# EAGLE design PCB_REVISION2WORKING (EAGLE 9.3.0)
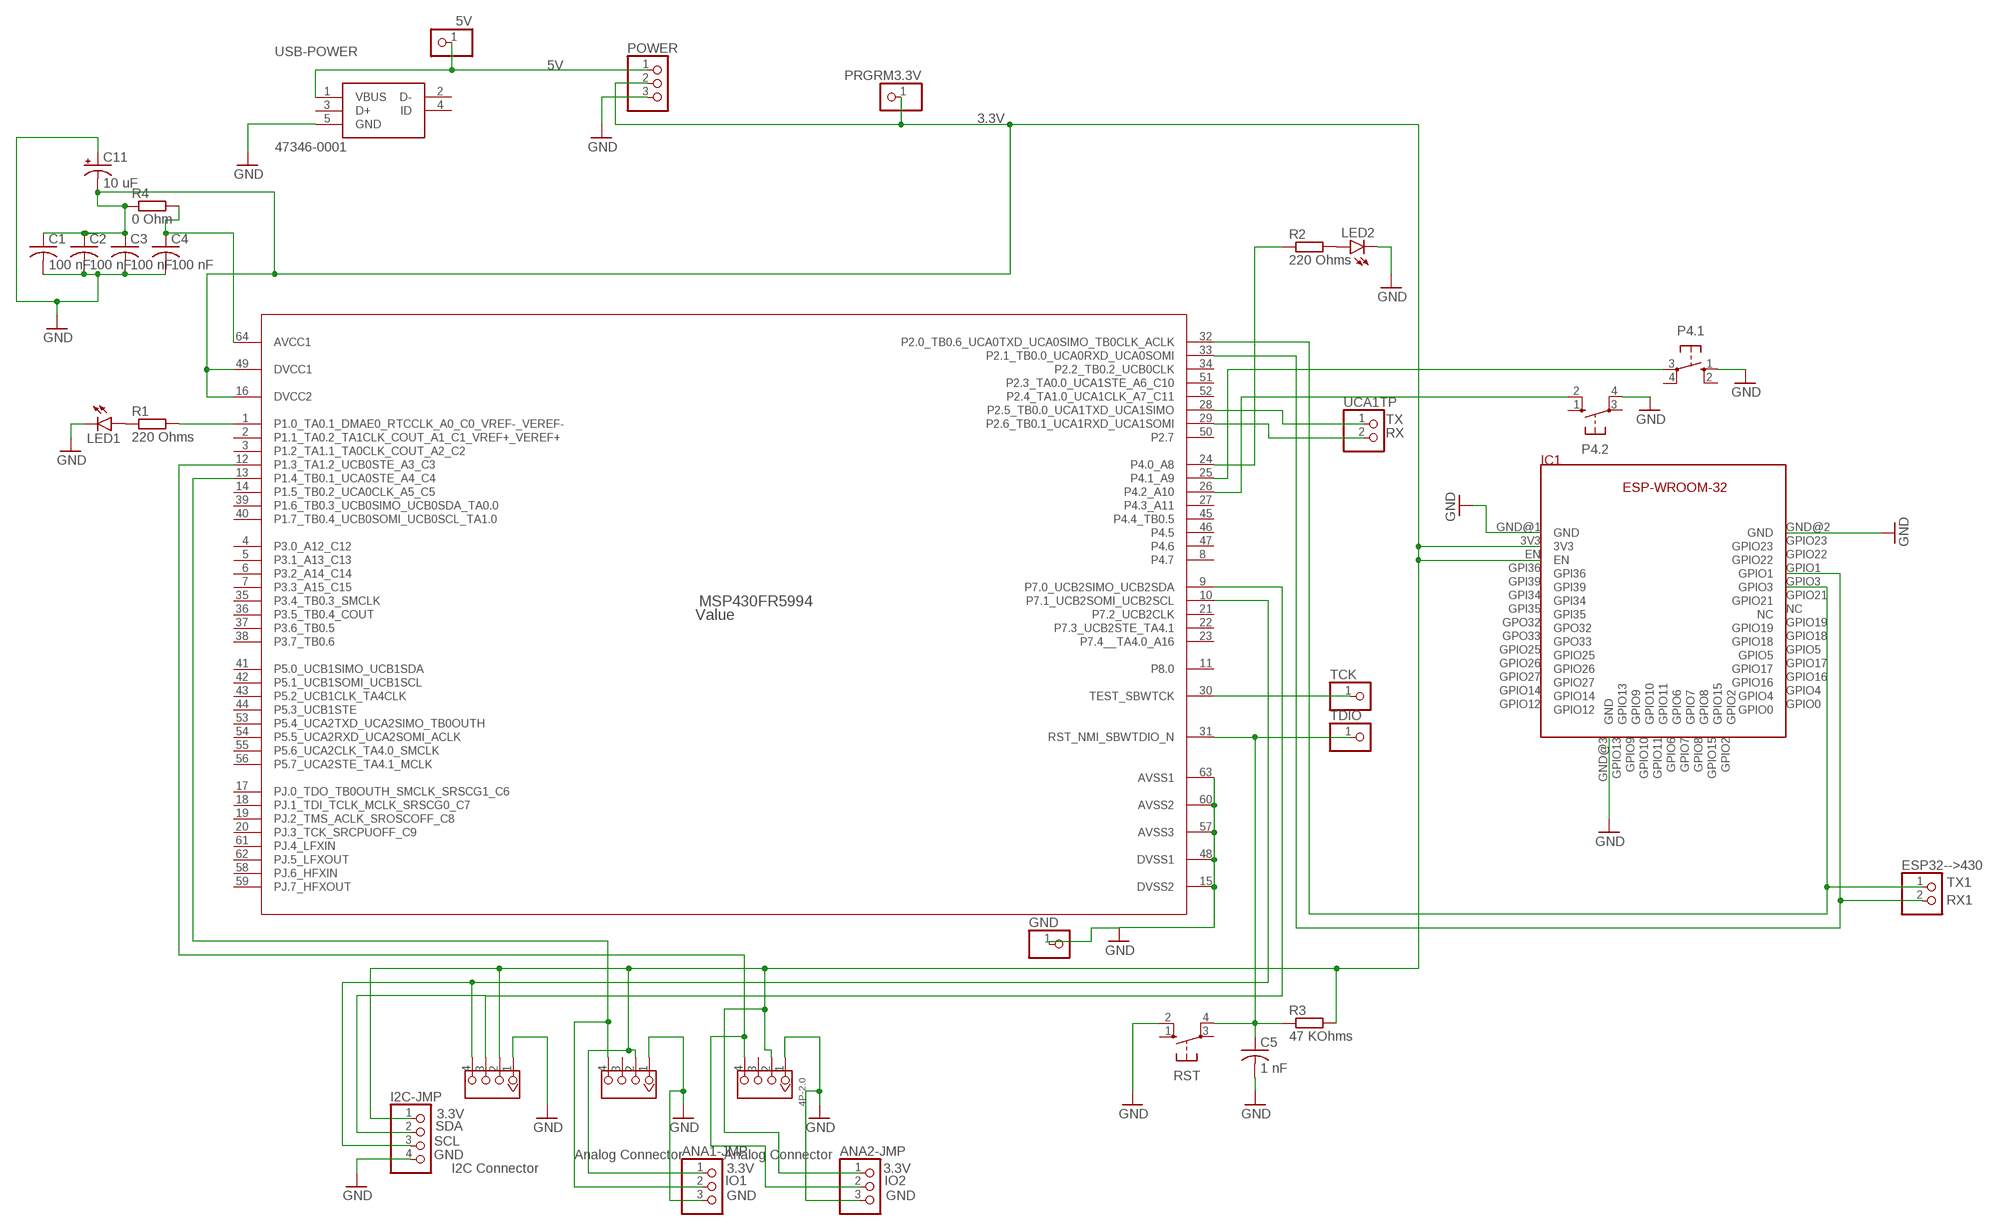
[diagram p0: schematic, sheet 1]

## Parts
5V  PINHD-1X1  [1X01]
ANA1-JMP  PINHD-1X3  [1X03]
ANA2-JMP  PINHD-1X3  [1X03]
ANALOG1  4P-2.0  GROVE-CONNECTOR-DIP(4P-2.0)  [HW4-2.0]
ANALOG2  4P-2.0  GROVE-CONNECTOR-DIP(4P-2.0)  [HW4-2.0]
C1  100 nF  C-USC0805K  [C0805K]
C2  100 nF  C-USC0805K  [C0805K]
C3  100 nF  C-USC0805K  [C0805K]
C4  100 nF  C-USC0805K  [C0805K]
C5  1 nF  C-USC0805K  [C0805K]
C11  10 uF  CPOL-USE5-6  [E5-6]
ESP32-->430  PINHD-1X2  [1X02]
GND  PINHD-1X1  [1X01]
I2C  4P-2.0  GROVE-CONNECTOR-DIP(4P-2.0)  [HW4-2.0]
I2C-JMP  PINHD-1X4  [1X04]
IC1  ESPWROOM32  [ESPWROOM32]
LED1  LED5MM  [LED5MM]
LED2  LED5MM  [LED5MM]
MSP430FR5994  Value  MSP430FR5964IPMR  [PM0064A_N]
P4.1  10-XX  [B3F-10XX]
P4.2  10-XX  [B3F-10XX]
POWER  PINHD-1X3  [1X03]
PRGRM3.3V  PINHD-1X1  [1X01]
R1  220 Ohms  R-EU_M1206  [M1206]
R2  220 Ohms  R-EU_M1206  [M1206]
R3  47 KOhms  R-EU_M1206  [M1206]
R4  0 Ohm  R-EU_M1206  [M1206]
RST  10-XX  [B3F-10XX]
TCK  PINHD-1X1  [1X01]
TDIO  PINHD-1X1  [1X01]
UCA1TP  PINHD-1X2  [1X02]
USB-POWER  47346-0001  [47346-0001]

## Nets
3.3V: ANA1-JMP.1 ANA2-JMP.1 ANALOG1.2 ANALOG2.2 C1.1 C2.1 C3.1 C11.- I2C-JMP.1 I2C.2 IC1.3V3 IC1.EN MSP430FR5994.16(DVCC2) MSP430FR5994.49(DVCC1) POWER.2 PRGRM3.3V.1 R3.2 R4.1
5V: 5V.1 POWER.1 USB-POWER.1(VBUS)
GND: ANA1-JMP.3 ANA2-JMP.3 ANALOG1.1 ANALOG2.1 C1.2 C2.2 C3.2 C4.2 C5.2 C11.+ GND.1 I2C-JMP.4 I2C.1 IC1.GND@1(GND) IC1.GND@2(GND) IC1.GND@3(GND) LED1.K(C) LED2.K(C) MSP430FR5994.15(DVSS2) MSP430FR5994.48(DVSS1) MSP430FR5994.57(AVSS3) MSP430FR5994.60(AVSS2) MSP430FR5994.63(AVSS1) P4.1.1(S) P4.2.4(P1) POWER.3 RST.2(S1) USB-POWER.5(GND)
IO1: ANA1-JMP.2 ANALOG1.4 MSP430FR5994.13(P1.4_TB0.1_UCA0STE_A4_C4)
IO2: ANA2-JMP.2 ANALOG2.4 MSP430FR5994.12(P1.3_TA1.2_UCB0STE_A3_C3)
N$2: LED1.A R1.1
N$3: LED2.A R2.2
N$10: MSP430FR5994.1(P1.0_TA0.1_DMAE0_RTCCLK_A0_C0_VREF-_VEREF-) R1.2
N$12: C5.1 MSP430FR5994.31(RST_NMI_SBWTDIO_N) R3.1 RST.4(P1) TDIO.1
N$13: MSP430FR5994.25(P4.1_A9) P4.1.3(P)
N$14: MSP430FR5994.26(P4.2_A10) P4.2.2(S1)
N$16: MSP430FR5994.24(P4.0_A8) R2.1
N$17: C4.1 MSP430FR5994.64(AVCC1) R4.2
N$21: MSP430FR5994.30(TEST_SBWTCK) TCK.1
RX: MSP430FR5994.29(P2.6_TB0.1_UCA1RXD_UCA1SOMI) UCA1TP.2
RX1: ESP32-->430.2 IC1.GPIO1 MSP430FR5994.33(P2.1_TB0.0_UCA0RXD_UCA0SOMI)
SCL: I2C-JMP.3 I2C.4 MSP430FR5994.10(P7.1_UCB2SOMI_UCB2SCL)
SDA: I2C-JMP.2 I2C.3 MSP430FR5994.9(P7.0_UCB2SIMO_UCB2SDA)
TX: MSP430FR5994.28(P2.5_TB0.0_UCA1TXD_UCA1SIMO) UCA1TP.1
TX1: ESP32-->430.1 IC1.GPIO3 MSP430FR5994.32(P2.0_TB0.6_UCA0TXD_UCA0SIMO_TB0CLK_ACLK)
Unconnected: ANALOG1.3 ANALOG2.3 IC1.GPI34 IC1.GPI35 IC1.GPI36 IC1.GPI39 IC1.GPIO0 IC1.GPIO2 IC1.GPIO4 IC1.GPIO5 IC1.GPIO6 IC1.GPIO7 IC1.GPIO8 IC1.GPIO9 IC1.GPIO10 IC1.GPIO11 IC1.GPIO12 IC1.GPIO13 IC1.GPIO14 IC1.GPIO15 IC1.GPIO16 IC1.GPIO17 IC1.GPIO18 IC1.GPIO19 IC1.GPIO21 IC1.GPIO22 IC1.GPIO23 IC1.GPIO25 IC1.GPIO26 IC1.GPIO27 IC1.GPO32 IC1.GPO33 IC1.NC MSP430FR5994.2(P1.1_TA0.2_TA1CLK_COUT_A1_C1_VREF+_VEREF+) MSP430FR5994.3(P1.2_TA1.1_TA0CLK_COUT_A2_C2) MSP430FR5994.4(P3.0_A12_C12) MSP430FR5994.5(P3.1_A13_C13) MSP430FR5994.6(P3.2_A14_C14) MSP430FR5994.7(P3.3_A15_C15) MSP430FR5994.8(P4.7) MSP430FR5994.11(P8.0) MSP430FR5994.14(P1.5_TB0.2_UCA0CLK_A5_C5) MSP430FR5994.17(PJ.0_TDO_TB0OUTH_SMCLK_SRSCG1_C6) MSP430FR5994.18(PJ.1_TDI_TCLK_MCLK_SRSCG0_C7) MSP430FR5994.19(PJ.2_TMS_ACLK_SROSCOFF_C8) MSP430FR5994.20(PJ.3_TCK_SRCPUOFF_C9) MSP430FR5994.21(P7.2_UCB2CLK) MSP430FR5994.22(P7.3_UCB2STE_TA4.1) MSP430FR5994.23(P7.4__TA4.0_A16) MSP430FR5994.27(P4.3_A11) MSP430FR5994.34(P2.2_TB0.2_UCB0CLK) MSP430FR5994.35(P3.4_TB0.3_SMCLK) MSP430FR5994.36(P3.5_TB0.4_COUT) MSP430FR5994.37(P3.6_TB0.5) MSP430FR5994.38(P3.7_TB0.6) MSP430FR5994.39(P1.6_TB0.3_UCB0SIMO_UCB0SDA_TA0.0) MSP430FR5994.40(P1.7_TB0.4_UCB0SOMI_UCB0SCL_TA1.0) MSP430FR5994.41(P5.0_UCB1SIMO_UCB1SDA) MSP430FR5994.42(P5.1_UCB1SOMI_UCB1SCL) MSP430FR5994.43(P5.2_UCB1CLK_TA4CLK) MSP430FR5994.44(P5.3_UCB1STE) MSP430FR5994.45(P4.4_TB0.5) MSP430FR5994.46(P4.5) MSP430FR5994.47(P4.6) MSP430FR5994.50(P2.7) MSP430FR5994.51(P2.3_TA0.0_UCA1STE_A6_C10) MSP430FR5994.52(P2.4_TA1.0_UCA1CLK_A7_C11) MSP430FR5994.53(P5.4_UCA2TXD_UCA2SIMO_TB0OUTH) MSP430FR5994.54(P5.5_UCA2RXD_UCA2SOMI_ACLK) MSP430FR5994.55(P5.6_UCA2CLK_TA4.0_SMCLK) MSP430FR5994.56(P5.7_UCA2STE_TA4.1_MCLK) MSP430FR5994.58(PJ.6_HFXIN) MSP430FR5994.59(PJ.7_HFXOUT) MSP430FR5994.61(PJ.4_LFXIN) MSP430FR5994.62(PJ.5_LFXOUT) P4.1.2(S1) P4.1.4(P1) P4.2.1(S) P4.2.3(P) RST.1(S) RST.3(P) USB-POWER.2(D-) USB-POWER.3(D+) USB-POWER.4(ID)

## Notes on the sheet
- Analog Connector | Analog Connector
- I2C Connector

## Library data of the parts
5V GND PRGRM3.3V TCK TDIO = pinhead:PINHD-1X1: PIN HEADER
ANA1-JMP ANA2-JMP POWER = pinhead:PINHD-1X3: PIN HEADER
ANALOG1 ANALOG2 I2C = Seeed-Connector -2016:GROVE-CONNECTOR-DIP(4P-2.0): 320110033
C1-C5 = rcl:C-US: CAPACITOR, American symbol; SPICEPREFIX: C
C11 = rcl:CPOL-US: POLARIZED CAPACITOR, American symbol; SPICEPREFIX: C
ESP32-->430 UCA1TP = pinhead:PINHD-1X2: PIN HEADER
I2C-JMP = pinhead:PINHD-1X4: PIN HEADER
IC1 = robotdyn:ESPWROOM32
LED1 LED2 = led:LED: LED OSRAM: - CHIPLED LG R971, LG N971, LY N971, LG Q971, LY Q971, LO R971, LY R971 LH N974, LH R974 LS Q976, LO Q976, LY Q976 LO Q996 - Hyper CHIPLED LW Q18S LB Q993, LB Q99A, LB R99A - SideLED LS A670, LO A670, LY A670, LG A670, LP A670 LB A673, LV A673, LT A673, LW A673 LH A674 LY A675 LS A676, LA A676, LO A676, LY A676, LW A676 LS A679, LY A679, LG A679 - Hyper Micro SIDELED® LS Y876, LA Y876, LO Y876, LY Y876 LT Y87S - SmartLED LW L88C, LW L88S LB L89C, LB L89S, LG L890 LS L89K, LO L89K, LY L89K LS L896, LA L896, LO L896, LY L896 - TOPLED LS T670, LO T670, LY T670, LG T670, LP T670 LSG T670, LSP T670, LSY T670, LOP T670, LYG T670 LG T671, LOG T671, LSG T671 LB T673, LV T673, LT T673, LW T673 LH T674 LS T676, LA T676, LO T676, LY T676, LB T676, LH T676, LSB T676, LW T676 LB T67C, LV T67C, LT T67C, LS T67K, LO T67K, LY T67K, LW E67C LS E67B, LA E67B, LO E67B, LY E67B, LB E67C, LV E67C, LT E67C LW T67C LS T679, LY T679, LG T679 LS T770, LO T770, LY T770, LG T770, LP T770 LB T773, LV T773, LT T773, LW T773 LH T774 LS E675, LA E675, LY E675, LS T675 LS T776, LA T776, LO T776, LY T776, LB T776 LHGB T686 LT T68C, LB T68C - Hyper Mini TOPLED® LB M676 - Mini TOPLED Santana® LG M470 LS M47K, LO M47K, LY M47K Source: http://www.osram.convergy.de LUXEON: - LUMILED® LXK2-PW12-R00, LXK2-PW12-S00, LXK2-PW14-U00, LXK2-PW14-V00 LXK2-PM12-R00, LXK2-PM12-S00, LXK2-PM14-U00 LXK2-PE12-Q00, LXK2-PE12-R00, LXK2-PE12-S00, LXK2-PE14-T00, LXK2-PE14-U00 LXK2-PB12-K00, LXK2-PB12-L00, LXK2-PB12-M00, LXK2-PB14-N00, LXK2-PB14-P00, LXK2-PB14-Q00 LXK2-PR12-L00, LXK2-PR12-M00, LXK2-PR14-Q00, LXK2-PR14-R00 LXK2-PD12-Q00, LXK2-PD12-R00, LXK2-PD12-S00 LXK2-PH12-R00, LXK2-PH12-S00 LXK2-PL12-P00, LXK2-PL12-Q00, LXK2-PL12-R00 Source: www.luxeon.com KINGBRIGHT: KA-3528ASYC Source: www.kingbright.com
MSP430FR5994 = MSP430 64-pin:MSP430FR5964IPMR; MANUFACTURER: Texas Instruments; PARTNUMBER: MSP430FR5964IPMR; REFDES: RefDes; TYPE: TYPE
P4.1 P4.2 RST = switch-omron:10-XX: OMRON SWITCH; MPN: B3F-1000; OC_FARNELL: 176432; OC_NEWARK: 36M3542
R1-R4 = rcl:R-EU_: RESISTOR, European symbol; SPICEPREFIX: R
USB-POWER = SamacSys_Parts:47346-0001: Micro USB B Receptacle Bottom Mount Assy Molex Right Angle SMT Type B Version 2.0 Micro USB Connector Socket, 30 V ac, 1A 47352 MICRO-USB Source: Datasheet <https://componentsearchengine.com/Datasheets/1/47346-0001.pdf>; DESCRIPTION: Micro USB B Receptacle Bottom Mount Assy Molex Right Angle SMT Type B Version 2.0 Micro USB Connector Socket, 30 V ac, 1A 47352 MICRO-USB; HEIGHT: mm; MANUFACTURER_NAME: Molex; MANUFACTURER_PART_NUMBER: 47346-0001; MOUSER_PART_NUMBER: 538-47346-0001; MOUSER_PRICE-STOCK: https://www.mouser.com/Search/Refine.aspx?Keyword=538-47346-0001

## Board
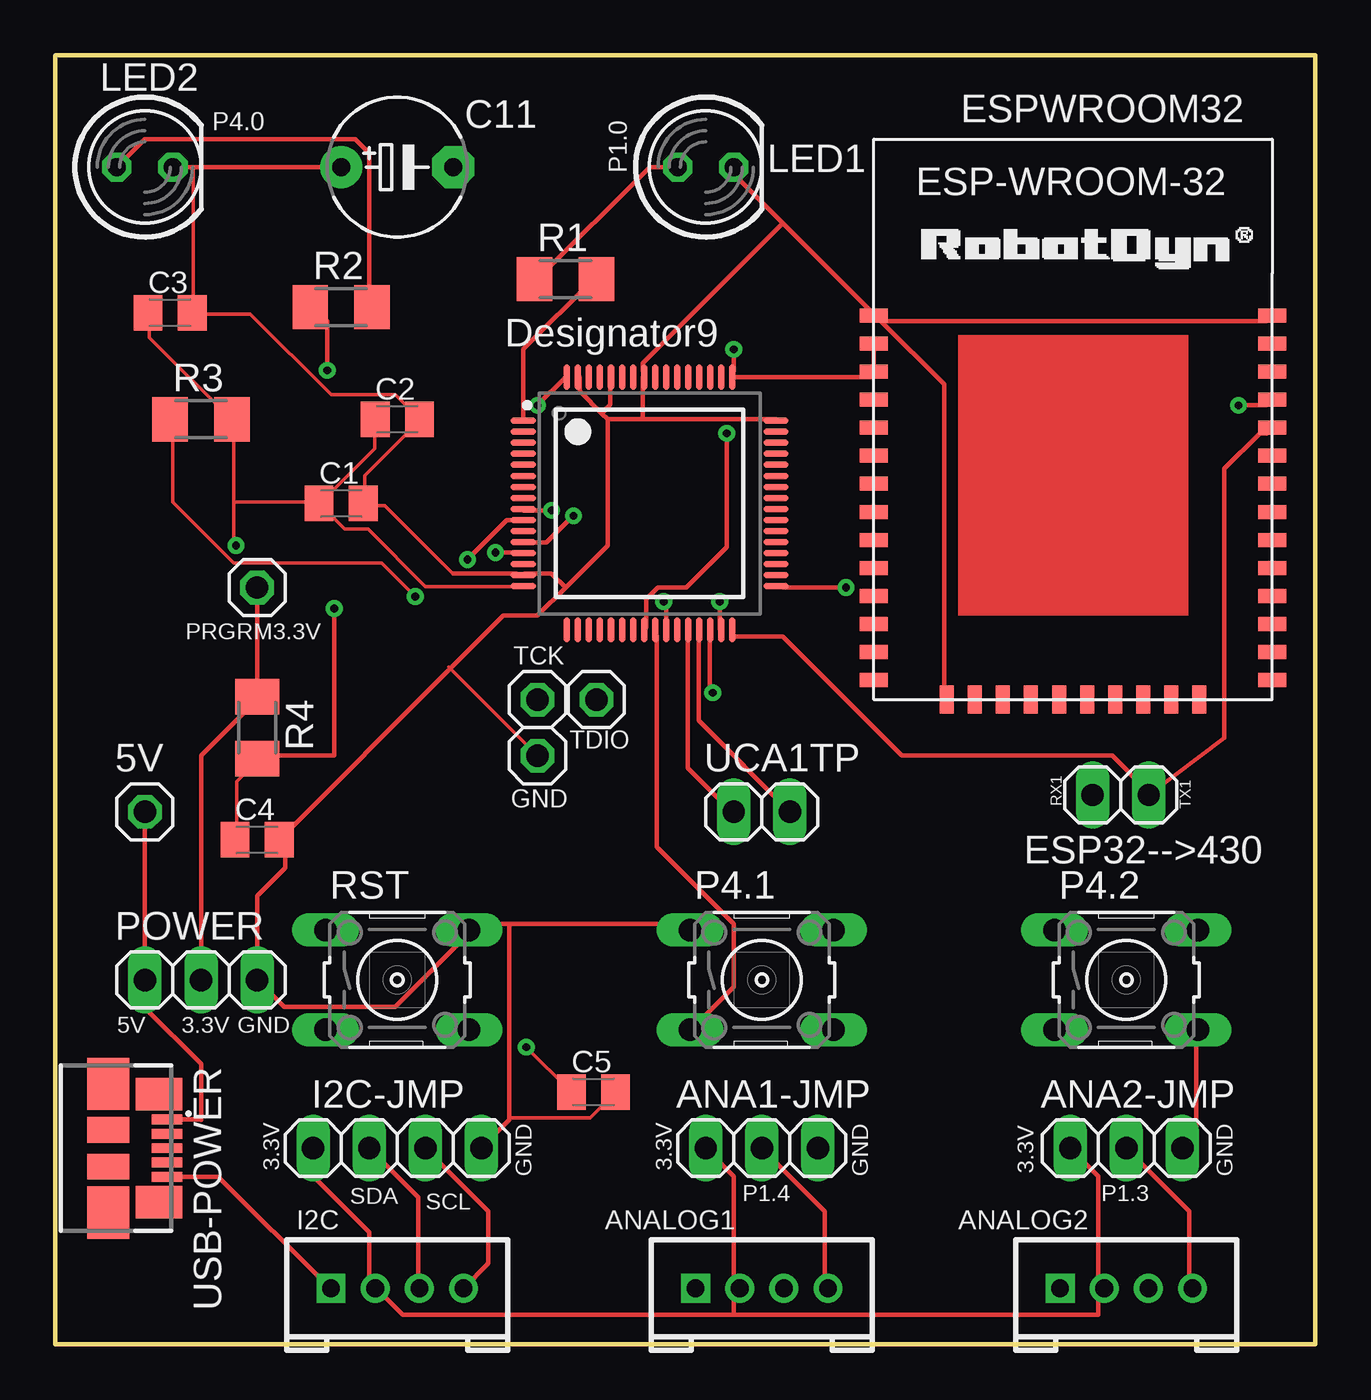
[diagram p1: board, top side]
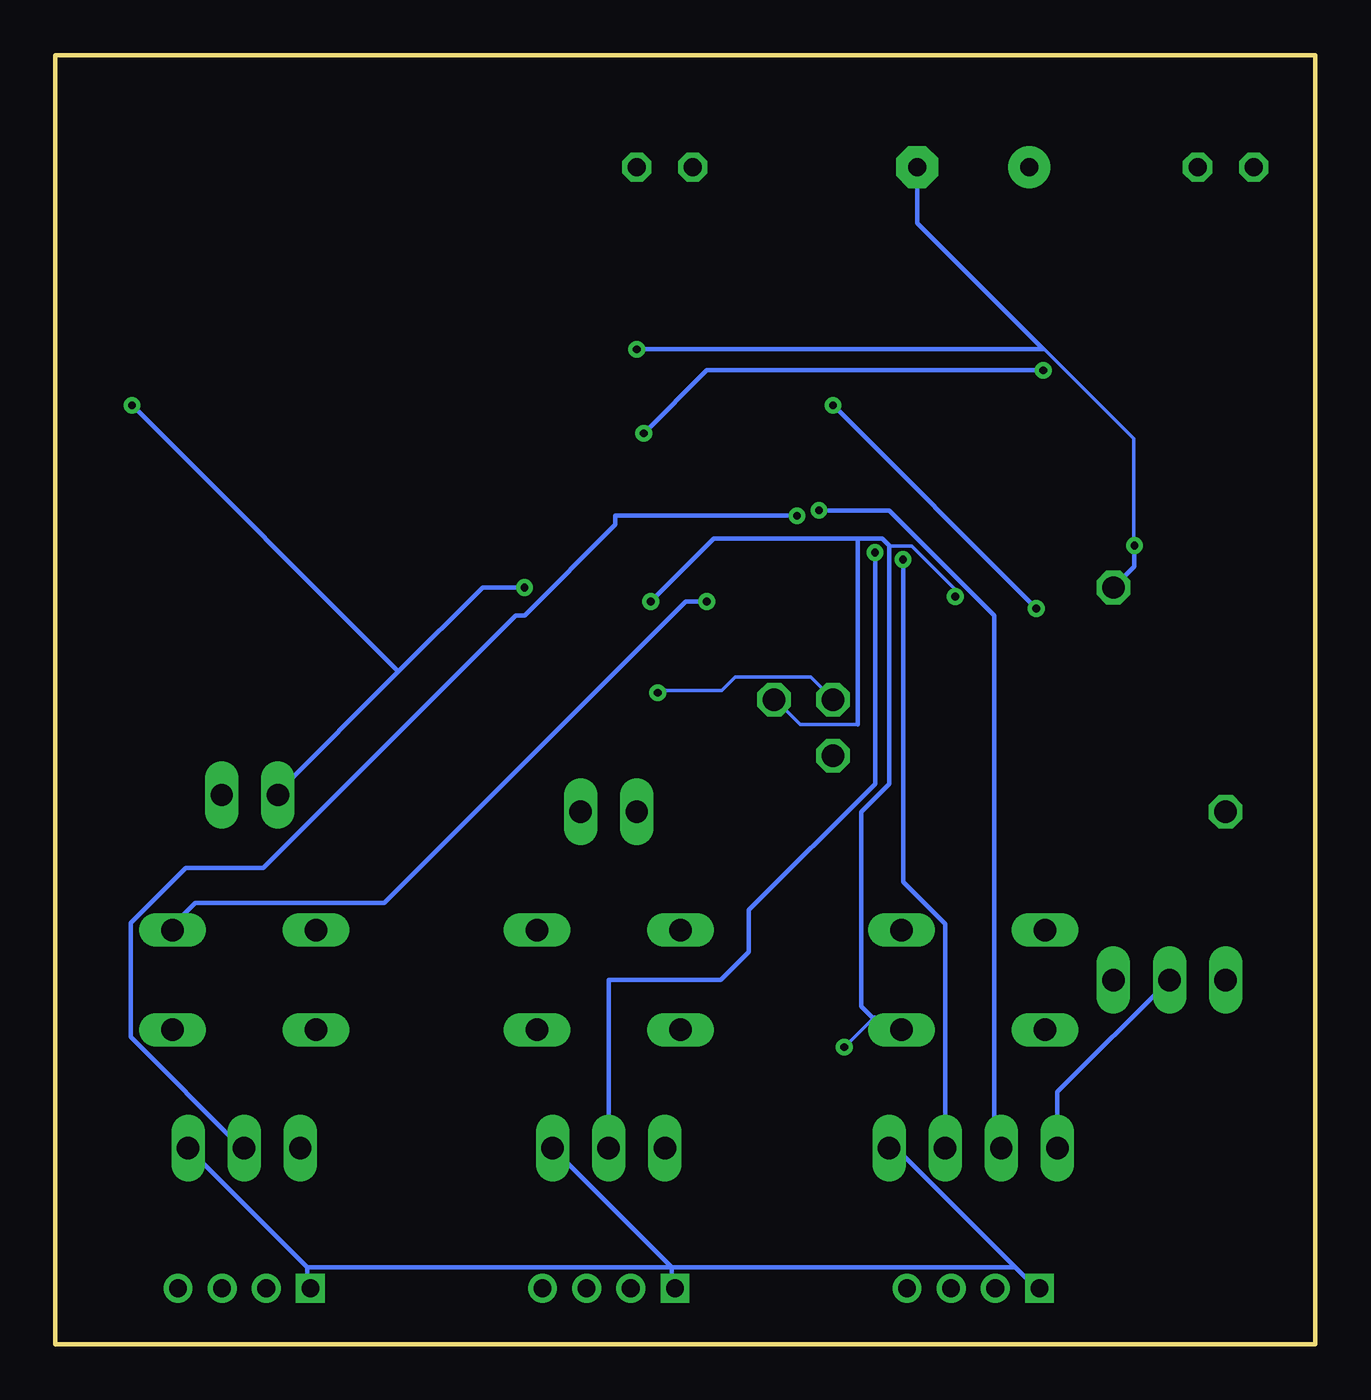
[diagram p2: board, bottom side, seen from below]

Size 57.07 x 58.41 mm. Coordinates in mm from the lower left corner, seen from the top.
Outline: 0,0 57.07,0 57.07,58.41 0,58.41 0,0
Copper layers (1*16): Top 0.035mm / dielectric 1.5mm / Bottom 0.035mm
Design rules "default": minimum track width 6mil, minimum drill 0.35mm, track to track 6mil, track to pad 6mil, pad to pad 6mil, via to via 6mil, smd to smd 6mil, copper to edge 40mil, drill to drill 6mil, minimum pad ring 10mil, minimum via ring 8mil, stop-mask expansion 4mil, vias tented up to drill 0mil, thermal gap 10mil

### Footprints (pad centres in the part's own frame; a part is rotated, then mirrored left to right if it is on the bottom)
1X01 = drill 1.016 octagon: 1 0,0
1X03 = drill 1.016 long: 1 -2.54,0; 2 0,0; 3 2.54,0
HW4-2.0 = drill 0.8 pad 1.27 square: 1 -3,0 | drill 0.8 pad 1.27: 2 -1,0; 3 1,0; 4 3,0
C0805K = smd 1.3 x 1.6: 1 -1,0; 2 1,0
E5-6 = drill 0.813 pad 1.905: + -2.54,0 | drill 0.813 pad 1.905 octagon: - 2.54,0
1X02 = drill 1.016 long: 1 -1.27,0; 2 1.27,0
1X04 = drill 1.016 long: 1 -3.81,0; 2 -1.27,0; 3 1.27,0; 4 3.81,0
ESPWROOM32 = smd 1.27 x 0.635: 3V3 -5.08,-1.651; EN -5.08,-2.921; GND@1 -5.08,-0.381; GND@2 12.954,-0.381; GPI34 -5.08,-6.731; GPI35 -5.08,-8.001; GPI36 -5.08,-4.191; GPI39 -5.08,-5.461; GPIO0 12.954,-16.891; GPIO1 12.954,-4.191; GPIO3 12.954,-5.461; GPIO4 12.954,-15.621; GPIO5 12.954,-11.811; GPIO12 -5.08,-16.891; GPIO14 -5.08,-15.621; GPIO16 12.954,-14.351; GPIO17 12.954,-13.081; GPIO18 12.954,-10.541; GPIO19 12.954,-9.271; GPIO21 12.954,-6.731; GPIO22 12.954,-2.921; GPIO23 12.954,-1.651; GPIO25 -5.08,-11.811; GPIO26 -5.08,-13.081; GPIO27 -5.08,-14.351; GPO32 -5.08,-9.271; GPO33 -5.08,-10.541; NC 12.954,-8.001 | smd 0.635 x 1.27: GND@3 -1.778,-17.78; GPIO2 9.652,-17.78; GPIO6 4.572,-17.78; GPIO7 5.842,-17.78; GPIO8 7.112,-17.78; GPIO9 0.762,-17.78; GPIO10 2.032,-17.78; GPIO11 3.302,-17.78; GPIO13 -0.508,-17.78; GPIO15 8.382,-17.78
LED5MM = drill 0.813 octagon: A -1.27,0; K 1.27,0
PM0064A_N = smd 1.15 x 0.3: 1 -5.725,3.75; 2 -5.725,3.25; 3 -5.725,2.75; 4 -5.725,2.25; 5 -5.725,1.75; 6 -5.725,1.25; 7 -5.725,0.75; 8 -5.725,0.25; 9 -5.725,-0.25; 10 -5.725,-0.75; 11 -5.725,-1.25; 12 -5.725,-1.75; 13 -5.725,-2.25; 14 -5.725,-2.75; 15 -5.725,-3.25; 16 -5.725,-3.75; 33 5.725,-3.75; 34 5.725,-3.25; 35 5.725,-2.75; 36 5.725,-2.25; 37 5.725,-1.75; 38 5.725,-1.25; 39 5.725,-0.75; 40 5.725,-0.25; 41 5.725,0.25; 42 5.725,0.75; 43 5.725,1.25; 44 5.725,1.75; 45 5.725,2.25; 46 5.725,2.75; 47 5.725,3.25; 48 5.725,3.75 | smd 0.3 x 1.15: 17 -3.75,-5.725; 18 -3.25,-5.725; 19 -2.75,-5.725; 20 -2.25,-5.725; 21 -1.75,-5.725; 22 -1.25,-5.725; 23 -0.75,-5.725; 24 -0.25,-5.725; 25 0.25,-5.725; 26 0.75,-5.725; 27 1.25,-5.725; 28 1.75,-5.725; 29 2.25,-5.725; 30 2.75,-5.725; 31 3.25,-5.725; 32 3.75,-5.725; 49 3.75,5.725; 50 3.25,5.725; 51 2.75,5.725; 52 2.25,5.725; 53 1.75,5.725; 54 1.25,5.725; 55 0.75,5.725; 56 0.25,5.725; 57 -0.25,5.725; 58 -0.75,5.725; 59 -1.25,5.725; 60 -1.75,5.725; 61 -2.25,5.725; 62 -2.75,5.725; 63 -3.25,5.725; 64 -3.75,5.725
B3F-10XX = drill 1.016 long: 1 -3.251,2.261; 2 3.251,2.261; 3 -3.251,-2.261; 4 3.251,-2.261
M1206 = smd 1.6 x 2: 1 -1.4,0; 2 1.4,0
47346-0001 = smd 0.45 x 1.38: 1 1.3,-4.81; 2 0.65,-4.81; 3 0,-4.81; 4 -0.65,-4.81; 5 -1.3,-4.81 | smd 1.475 x 2.1: 6 -2.453,-4.45; 7 2.453,-4.45 | smd 1.175 x 1.9: 8 0.838,-2.15; 9 -0.838,-2.15 | smd 2.375 x 1.9: 10 2.913,-2.15; 11 -2.913,-2.15

### Placement (x,y rotation side)
5V  4.06,24.13 0 top
ANA1-JMP  32,8.89 0 top
ANA2-JMP  48.51,8.89 0 top
ANALOG1  32,2.54 0 top
ANALOG2  48.51,2.54 0 top
C1  12.95,38.1 0 top
C2  15.49,41.91 0 top
C3  5.21,46.74 0 top
C4  9.14,22.86 0 top
C5  24.38,11.43 0 top
C11  15.49,53.34 0 top
ESP32-->430  48.26,24.89 180 top
GND  21.84,26.67 0 top
I2C  15.49,2.54 0 top
I2C-JMP  15.49,8.89 0 top
IC1  42.16,46.99 0 top
LED1  29.46,53.34 0 top
LED2  4.06,53.34 0 top
MSP430FR5994  26.92,38.1 0 top
P4.1  32,16.51 0 top
P4.2  48.51,16.51 0 top
POWER  6.6,16.51 0 top
PRGRM3.3V  9.14,34.29 0 top
R1  23.11,48.26 0 top
R2  12.95,46.99 0 top
R3  6.6,41.91 0 top
R4  9.14,27.94 270 top
RST  15.49,16.51 0 top
TCK  21.84,29.21 0 top
TDIO  24.51,29.21 0 top
UCA1TP  32,24.13 0 top
USB-POWER  0.25,8.89 90 top

### Tracks (layer width: path | path; a pad name or v marks a point on that pad's centre or on a via)
3.3V  (via drill 0.35)
  Top 0.152: C3.1 4.27,46.69 4.27,45.62 7.92,41.96 R3.2 8.08,41.81 8.08,38.15 | 8.08,38.15 8.08,36.32 v8.19,36.19 | MSP430FR5994.16 20.88,34.34 16.76,34.34 14.17,36.93 13.11,36.93 12.04,38 C1.1 | C2.1 14.48,41.81 14.48,40.59 12.04,38.15 C1.1 | 8.08,38.15 11.89,38.15 C1.1
  Top 0.203: IC1.3V3 IC1.EN 37.08,43.81 30.73,43.81 MSP430FR5994.49 30.73,44.13 v30.73,45.08 | PRGRM3.3V.1 R4.1 9.14,29.21 6.6,26.67 POWER.2 | 47.24,2.54 47.24,7.62 ANA2-JMP.1 | 47.24,2.54 47.24,1.33 30.73,1.33 | 30.73,2.54 30.73,7.62 ANA1-JMP.1 | 30.73,2.54 30.73,1.33 | I2C-JMP.1 11.68,7.62 14.22,5.08 14.22,2.54 I2C.2 14.54,2.54 15.75,1.33 30.73,1.33 | 30.73,2.54 ANALOG1.2 | 47.24,2.54 ANALOG2.2
  Bottom 0.152: v8.19,36.19 8.23,36.32 8.23,41.05 12.34,45.16 12.34,45.08
  Bottom 0.203: v8.19,36.19 8.19,35.24 PRGRM3.3V.1 | C11.- 18.03,50.8 12.32,45.08 12.34,45.08 v30.73,45.08 | I2C-JMP.1 11.68,11.43 POWER.2
5V
  Top 0.203: 5V.1 POWER.1 4.06,15.24 6.6,12.7 6.6,10.16 6.57,10.19 USB-POWER.1
GND
  Top 0.152: 6.25,53.34 6.25,46.84 C3.2 6.25,46.69 8.84,46.69 12.5,43.03 15.39,43.03 16.46,41.96 C2.2 16.46,41.81 14.02,39.37 14.02,38.15 C1.2 14.02,38 14.93,38 17.98,34.95 18.03,34.92 | 20.57,10.26 24.23,10.26 25.3,11.33 C5.2 | GND.1 17.9,30.61 17.83,30.68
  Top 0.203: C11.+ 6.25,53.34 LED2.K | 18.03,34.92 20.89,34.92 MSP430FR5994.15 21.27,34.92 22.48,34.92 23.11,34.29 | 25.02,41.91 24.75,42.18 | 24.75,42.18 23.75,43.18 23.75,43.81 MSP430FR5994.63 | 26.61,41.91 32.64,41.91 MSP430FR5994.48 | 26.61,41.91 25.02,41.91 | 26.61,41.91 26.61,43.81 MSP430FR5994.57 26.61,44.13 26.61,44.45 32.96,50.8 | 32.96,50.8 30.73,53.02 LED1.K | 32.96,50.8 37.08,46.67 | 37.08,46.67 37.4,46.35 | 37.4,46.35 40.26,43.5 40.26,29.21 IC1.GND@3 | 37.08,46.67 IC1.GND@1 37.4,46.35 | 37.4,46.35 54.86,46.35 IC1.GND@2 | 20.57,19.05 28.51,19.05 P4.1.1 | 20.57,19.05 18.99,19.05 RST.2 18.74,18.64 15.39,15.29 10.36,15.29 POWER.3 9.14,20.32 10.41,21.59 10.41,22.59 C4.2 17.9,30.61 20.3,33.02 21.84,33.02 23.11,34.29 | ANA2-JMP.3 51.69,9.52 51.69,13.97 P4.2.4 | 20.57,19.05 20.57,10.26 20.57,10.16 I2C-JMP.4 | 24.75,42.18 25.15,42.57 25.15,43.79 MSP430FR5994.60 | I2C.1 12.34,2.64 7.4,7.59 USB-POWER.5 | 23.11,34.29 25.02,36.19 25.02,41.91
  Bottom 0.203: 45.66,3.49 45.66,2.54 ANALOG2.1 | ANA2-JMP.3 45.66,3.49 | 29.15,3.49 29.15,2.54 ANALOG1.1 | ANA1-JMP.3 29.15,3.49 | 13.59,3.49 18.99,8.89 I2C-JMP.4 | 13.59,3.49 12.64,2.54 I2C.1 | 13.59,3.49 29.15,3.49 | 29.15,3.49 45.66,3.49
IO1  (via drill 0.35)
  Top 0.203: v19.94,35.88 20.89,35.88 MSP430FR5994.13 | ANA1-JMP.2 34.86,6.03 34.86,2.54 ANALOG1.4
  Bottom 0.203: v19.94,35.88 19.94,25.4 25.65,19.68 25.65,17.78 26.92,16.51 32,16.51 ANA1-JMP.2
IO2  (via drill 0.35)
  Top 0.203: ANA2-JMP.2 51.37,6.03 51.37,2.54 ANALOG2.4 | v23.47,37.54 22.25,36.32 21.34,36.32 MSP430FR5994.12
  Bottom 0.203: v23.47,37.54 31.7,37.54 31.7,37.14 35.81,33.02 36.22,33.02 47.65,21.59 51.16,21.59 53.65,19.1 53.65,13.92 48.62,8.89 ANA2-JMP.2
N$2
  Top 0.203: LED1.A 26.92,53.34 21.84,48.26 R1.1
N$3
  Top 0.203: LED2.A 4.06,54.61 13.59,54.61 14.22,53.97 14.22,46.99 R2.2
N$10
  Top 0.203: MSP430FR5994.1 21.21,41.91 21.21,45.08 24.38,48.26 R1.2
N$12  (via drill 0.35)
  Top 0.152: 23.47,11.48 C5.1 23.32,11.48 v21.34,13.46 | v16.31,33.88 14.78,35.41 8.08,35.41 5.33,38.15 5.33,41.81 R3.1
  Top 0.203: v30.1,33.66 30.1,32.39 MSP430FR5994.31
  Bottom 0.152: v16.31,33.88 16.31,34.19 18.29,36.17 19.3,36.17 | v21.34,13.46 19.96,14.83 RST.4 | 20.73,28.09 23.32,28.09 24.38,29.16 TDIO.1
  Bottom 0.203: 20.73,36.51 27.24,36.51 v30.1,33.66 | 20.73,36.51 19.62,36.51 19.3,36.19 19.3,36.17 19.3,25.4 20.57,24.13 20.57,15.3 19.52,14.25 RST.4 | 20.73,28.09 20.73,36.51
N$13
  Top 0.203: MSP430FR5994.25 27.24,32.07 27.24,22.54 30.73,19.05 30.73,16.19 28.83,14.29 P4.1.3
N$14  (via drill 0.35)
  Top 0.203: v27.56,33.66 27.69,33.53 27.69,32.39 MSP430FR5994.26
  Bottom 0.203: v27.56,33.66 28.51,33.66 42.16,20 50.74,20 51.69,19.05 P4.2.2
N$16  (via drill 0.35)
  Top 0.203: v30.42,41.28 30.42,36.12 28.59,34.29 27.3,34.29 26.77,33.76 26.77,32.47 MSP430FR5994.24 | v12.32,44.13 12.32,46.35 11.68,46.99 R2.1
  Bottom 0.203: v30.42,41.28 27.56,44.13 v12.32,44.13
N$17  (via drill 0.35)
  Top 0.152: C4.1 8.23,22.91 8.23,25.5 9.14,26.42 R4.2
  Top 0.203: R4.2 9.14,26.67 12.64,26.67 v12.64,33.34 | v21.84,42.55 23.11,43.81 MSP430FR5994.64
  Bottom 0.203: v12.64,33.34 v21.84,42.55
N$21  (via drill 0.35)
  Top 0.203: v29.78,29.53 29.65,29.65 29.65,32.36 MSP430FR5994.30
  Bottom 0.152: TCK.1 22.86,30.23 26.26,30.23 26.87,29.62 29.72,29.62 v29.78,29.53
RX
  Top 0.203: UCA1TP.2 29.15,28.26 29.15,32.07 MSP430FR5994.29
RX1  (via drill 0.35)
  Top 0.203: v35.81,34.29 32.96,34.29 MSP430FR5994.33 | v53.59,42.55 54.86,42.55 IC1.GPIO1
  Bottom 0.203: v35.81,34.29 37.72,34.29 41.53,30.48 | 41.53,30.48 46.93,25.08 ESP32-->430.2 | 41.53,30.48 v53.59,42.55
SCL  (via drill 0.35)
  Top 0.203: MSP430FR5994.10 21.19,37.34 20.45,37.34 v18.67,35.56 | I2C.4 19.62,3.67 19.62,6.03 I2C-JMP.3
  Bottom 0.203: v18.67,35.56 18.67,20.96 16.76,19.05 I2C-JMP.3
SDA  (via drill 0.35)
  Top 0.203: v22.48,37.78 21.21,37.78 MSP430FR5994.9 | I2C-JMP.2 16.45,6.67 16.45,2.54 I2C.3
  Bottom 0.203: v22.48,37.78 19.3,37.78 14.54,33.02 14.54,9.21 I2C-JMP.2
TX
  Top 0.203: MSP430FR5994.28 28.65,32.36 28.65,26.11 30.63,24.13 UCA1TP.1
TX1
  Top 0.203: MSP430FR5994.32 30.73,32.07 32.96,32.07 38.35,26.67 47.88,26.67 49.47,25.08 ESP32-->430.1 52.96,27.46 52.96,39.69 54.55,41.28 54.86,41.28 IC1.GPIO3

### Text on the board
tNames: P4.0 | P1.0 | RX1 | TX1 | 5V | 3.3V | GND | 3.3V | GND | 3.3V | GND | 3.3V | GND | SDA | SCL | P1.4 | P1.3